# Altium project water_quality.PrjPcb
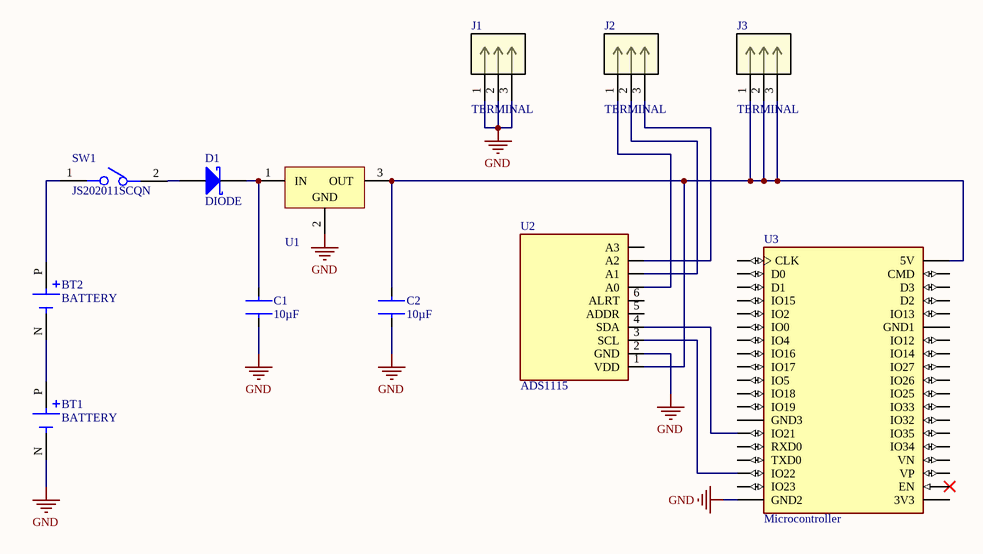
[diagram p0: water_quality.SchDoc]
1 sheet, 12 parts. Net scope: global (net labels, ports and power ports of the same name join across sheets).
Board file: water_quality.PcbDoc

## Sheet water_quality.SchDoc
size A; SheetNumber: 1; SheetTotal: 1

### Parts
BT1  BATTERY  [BATTERY_HOLDER_1043]
BT2  BATTERY  [BATTERY_HOLDER_1043]
C1  10µF  [293D106X9025C2T]
C2  10µF  [293D106X9025C2T]
D1  DIODE  [DIODE]
J1  TERMINAL  [SCREW_TERMINAL]
J2  TERMINAL  [SCREW_TERMINAL]
J3  TERMINAL  [SCREW_TERMINAL]
SW1  JS202011SCQN  [SWITCH]
U1  MC7805CTG  [MC7805CTG]  (value not drawn)
U2  ADS1115  [ADS1115]
U3  Microcontroller  [ESP32_WROOM_32E]

### Nets
GND: BT1.N(NEG) C1.1 C2.1 J1.1 J1.2 J1.3 U1.2(GND) U2.2(GND) U3.20(GND2)
NetBT1_P: BT1.P(POS) BT2.N(NEG)
NetBT2_P: BT2.P(POS) SW1.1
NetC1_2: C1.2 D1.2(K) U1.1(IN)
NetC2_2: C2.2 J3.1 J3.2 J3.3 U1.3(OUT) U2.1(VDD) U3.19(5V)
NetD1_1: D1.1(A) SW1.2
NetJ2_1: J2.1 U2.7(A0)
NetJ2_2: J2.2 U2.8(A1)
NetJ2_3: J2.3 U2.9(A2)
NetU2_3: U2.3(SCL) U3.22(IO22)
NetU2_4: U2.4(SDA) U3.25(IO21)

Not connected (* = marked no-connect by the designer): U2 5(ADDR) 6(ALRT) 10(A3); U3 1(3V3) 2(EN)* 3(VP) 4(VN) 5(IO34) 6(IO35) 7(IO32) 8(IO33) 9(IO25) 10(IO26) 11(IO27) 12(IO14) 13(IO12) 14(GND1) 15(IO13) 16(D2) 17(D3) 18(CMD) 21(IO23) 23(TXD0) 24(RXD0) 26(GND3) 27(IO19) 28(IO18) 29(IO5) 30(IO17) 31(IO16) 32(IO4) 33(IO0) 34(IO2) 35(IO15) 36(D1) 37(D0) 38(CLK)

### Library data of the parts
BT1 BT2 = BATTERY_HOLDER_1043: SMT Polarized Holder for 18650 Battery; MF: Keystone Electronics; MP: 1042P; Price: None; Purchase-URL: https://pricing.snapeda.com/search/part/1042P/?ref=eda; Check_prices: https://www.snapeda.com/parts/1042P/Keystone+Electronics/view-part/?ref=eda; Value: *; SnapEDA_Link: https://www.snapeda.com/parts/1042P/Keystone+Electronics/view-part/?ref=snap; Availability: In Stock; Package: None
C1 C2 = 293D106X9025C2T: Tantalum Capacitor, Polarized, Tantalum (dry/solid), 25V, 10% +Tol, 10% -Tol, 10uF, Surface Mount, 2312; Manufacturer: Vishay; ESR (Equivalent Series Resistance): 1.5R; Leakage Current: 2.5uA; Ripple Current: 270mA; Tan Delta: 0.06; Supplier: Arrow Electronics; Supplier Part Number: 293D106X9025C2T; Manufacturer Part Number: 293D106X9025C2T; RoHS: Yes; Category: Tantalum Capacitors; Pricing: 500=0.2335, 1000=0.2312, 2000=0.2289, 2500=0.2266, 3000=0.2243, 4000=0.2221, 5000=0.2198, 10000=0.2176, 20000=0.2155 (USD); Mounting Technology: Surface Mount; Pins: 2; Dielectric Material: Tantalum; Package Shape: Rectangular; Case/Package: 2312; Terminal Finish: Tin; Min Operating Temperature: -55°C; Max Operating Temperature: 125°C; Polarity: Polarized; Value: 10uF; Capacitor Type: Tantalum; Tolerance  (fill in as +-): 10%; Package Style: SMTMeter; Packaging: Tape and Reel; Tolerance (fill in as +-): 10%; Rated DC Voltage (URdc): 25V; Termination: Wraparound; Length: 6mm; Width: 3.2mm; Height: 2.5mm; RoHS Compliant: Yes; ComponentLink1URL: https://datasheet.ciiva.com:443/pdfs/VipMasterIC/IC/VISH/VISHS28296/VISHS28296-1.pdf?src-supplier=IHS+Markit; ComponentLink1Description: https://datasheet.ciiva.com:443/pdfs/VipMasterIC/IC/VISH/VISHS28296/VISHS28296-1.pdf?src-supplier=IHS+Markit; ComponentLink2URL: https://datasheet.ciiva.com/12899/293d-239871-12899927.pdf?src-supplier=Mouser; ComponentLink2Description: https://datasheet.ciiva.com/12899/293d-239871-12899927.pdf?src-supplier=Mouser; ComponentLink3URL: https://datasheet.ciiva.com/16332/293d-16332437.pdf?src-supplier=Future+Electronics; ComponentLink3Description: https://datasheet.ciiva.com/16332/293d-16332437.pdf?src-supplier=Future+Electronics
D1 = DIODE: Small Signal Schottky Diode, 150 mA, 100 V, -65 to 125 degC, 2-Pin DO-35, RoHS, Tape and Reel; Manufacturer: STMicroelectronics; SVHC: NoSVHC(15-Jun-2015); Diode Configuration: Single; No. of Pins: 2Pins; Forward Surge Current Ifsm Max: 750mA; Repetitive Reverse Voltage Vrrm Max: 100V; Diode Case Style: DO-204AH; Forward Voltage VF Max: 1V; Forward Current If(AV): 150mA; Manufacturer URL: http://www.st.com/; Packaging: Tape&Reel; Package Reference: DO-35-2; Datasheet URL: http://www.st.com/content/ccc/resource/technical/document/datasheet/group1/11/76/e4/a3/df/07/49/14/CD00000767/files/CD00000767.pdf/jcr:content/translations/en.CD00000767.pdf; Diode Type: Schottky; Mounting Technology: ThroughHole; Package Description: 2-Pin Axial Lead, Dia 1.765 mm, Body Length 3.775 mm; Product Range: -; Datasheet Version: Rev. 2.1, 10/2001; Operating Temperature Max: 125°C
J1-J3 = SCREW_TERMINAL: No Description Available; Mfr_Name: On Shore Technology; RefDes: RefDes; Type: Type
SW1 = SWITCH: SWITCH SLIDE DPDT 300MA 6V; Switch Function: On-On; Actuator Type: Standard; Switch Travel: 2mm; Actuator Color: Black; Contact Resistance: 70mR; Electrical Life: 5000Cycles; Actuator Material: Nylon; REACH SVHC: No SVHC; Series: JS; Min Operating Temperature: -20°C; Depth: 7.5mm; Housing Material: Nylon; Voltage Rating (DC): 6V; Max Operating Temperature: 85°C; Contact Current Rating: 300mA; Package Quantity: 1; Contact Plating: Silver; Contact Material: Copper Alloy; Throw Configuration: DPDT; Current Rating: 300mA; Orientation: Vertical; Max Current Rating: 300mA; Max Voltage Rating (DC): 6V; Flammability Rating: UL94 V-2; Length: 9mm; Packaging: Tape and Reel; Mount: Surface Mount; Actuator Length: 2mm; Lead Free: Lead Free; Termination: Gull Wing; Radiation Hardening: No
U1 = MC7805CTG: Positive Voltage Regulator, 1 A, 5 V, 0 to 125 degC, 3-Pin TO-220, RoHS, Tube; Manufacturer: ON Semiconductor; Resistance, Thermal, Junction to Case: 5degC/W; Voltage, Supply: 35V; Regulator Function: Standard; Temperature, Operating, Maximum: +125degC; Load Regulation: 25mV; Regulator Type: PositiveVoltageOut; Current, Output, Maximum: 1A; Regulation, Load: 1.3mV; Number of Outputs: 1; Temperature, Operating, Range: 0to+125degC; Regulation, Line: 0.5mV; Line Regulation: 20mV; Voltage, Input Range: Maximumof35V; Output Type: Fixed; Current, Quiescent Supply: 6.5mA; Dropout Voltage: 2V; Temperature, Operating, Minimum: 0degC; Package Version: Rev. A, 11/2010; Current, Supply: 3.2mA; Voltage, Output: 5V; Voltage, Noise: 10μV/V; Package Type: TO-220; Voltage, Input, High Level: 35V; Datasheet URL: http://www.onsemi.com/pub_link/Collateral/MC7800-D.PDF; Dimensions: 10.28x4.82x15.75mm; Width: 4.82mm; Type: VoltageRegulator; Mounting Type: ThroughHole; Polarity: Positive; Datasheet Version: Rev. 27, 11/2014; Height: 15.75mm; Dropout Voltage Measurement Current: 1A; Package Description: 3-Pin Flange Mount, Vertical Straight Lead, Body 9.97 x 4.445 mm, Pitch 2.54 mm; Manufacturer URL: http://www.onsemi.com/; Voltage, Dropout: 2V; Length: 10.28mm; Number of Pins: 3; Package Reference: TO-220-3-221AB-01
U2 = ADS1115: MF: {'manufacturer': u'Adafruit Industries LLC'}; MP: 1085; Package: None; Price: None; Value: *; Availability: Unavailable
U3 = ESP32_WROOM_32E: ESP32-WROOM-32E Transceiver; 802.11 b/g/n (Wi-Fi, WiFi, WLAN), BluetoothÂ® Smart Ready 4.x Dual Mode 2.4GHz Evaluation Board; MF: Espressif Systems; MP: ESP32-DEVKITC-32E; SnapEDA_Link: https://www.snapeda.com/parts/ESP32-DEVKITC-32E/Espressif+Systems/view-part/?ref=snap; Package: None; Value: *; Check_prices: https://www.snapeda.com/parts/ESP32-DEVKITC-32E/Espressif+Systems/view-part/?ref=eda